# Altium schematic sheet Relay controll extension board v1.5.SchDoc: Power Relay board
size A4; DrawnBy: oaba200; Revision: CBD200509-11 V1.5
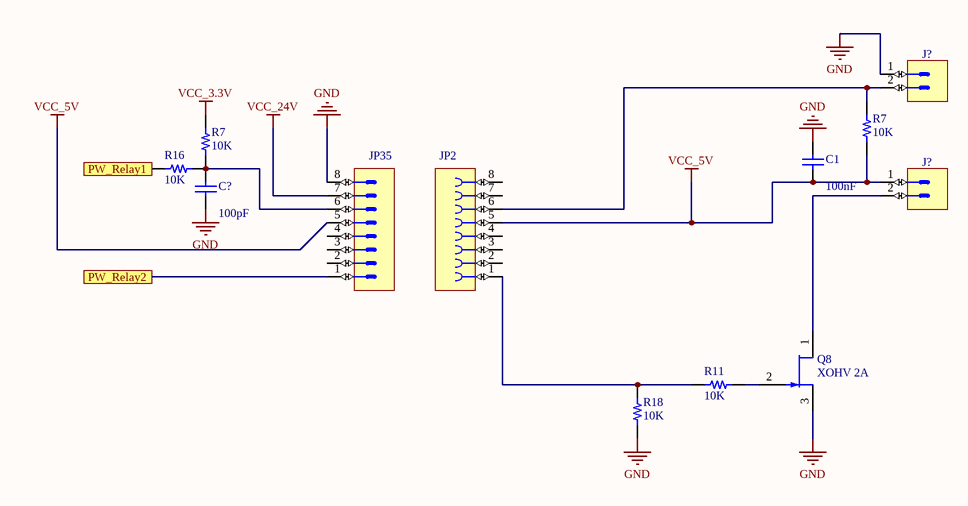
[diagram p0: Relay controll extension board v1.5.SchDoc]

## Parts
(Parts that share a designator on the sheet are numbered #1, #2 ... from top to bottom, then left to right.)
C1  value 100nF  [C1206]  (hidden comment: Cap Semi)
C?  value 100pF  [C1206]  (hidden comment: Cap Semi)
J?#1  (no value)
J?#2  (no value)
JP2  (no value)
JP35  (no value)
Q8  XOHV 2A  [TO-254-AA]
R7#1  10K  [RES 0805_2012]
R7#2  10K  [RES 0805_2012]
R11  10K  [RES 0805_2012]
R16  10K  [RES 0805_2012]
R18  10K  [RES 0805_2012]

## Ports
PW_Relay1, PW_Relay2

## Nets
GND: C1.2 C?.1 J?#1.1 JP35.8 Q8.3(S) R18.2
VCC_3.3V: R7#2.1
VCC_5V: C1.1 J?#2.1 JP2.5 JP35.5 R7#1.1
VCC_24V: JP35.7
PW_Relay1: R16.1 ; port PW_Relay1
PW_Relay2: JP35.1 ; port PW_Relay2
NetC?_2: C?.2 JP35.6 R7#2.2 R16.2
NetJ?#1_2: J?#1.2 JP2.6 R7#1.2
NetJ?#2_2: J?#2.2 Q8.1(D)
NetJP2_1: JP2.1 R11.1 R18.1
NetQ8_2: Q8.2(G) R11.2

Not connected (* = marked no-connect by the designer): JP2 2 3 4 7 8; JP35 2 3 4

## Library data of the parts
C1 C? = Cap Semi: Capacitor (Semiconductor SIM Model); Published: 8-Jun-2000; LatestRevisionDate: 29-May-2009; LatestRevisionNote: IPC-7351 Footprint Added.; PackageReference: C1206; Publisher: Altium Limited; PackageDescription: Chip Capacitor
J?#1 J?#2 = Connector 2 Male
JP2 = Connector 8 Female
JP35 = Connector 8 Male
Q8 = JFET-N: N-Channel JFET; Published: 8-Jun-2000; LatestRevisionDate: 17-Jul-2002; LatestRevisionNote: Re-released for DXP Platform.; PackageReference: TO-254-AA; Publisher: Altium Limited; Code_JEDEC: TO-254-AA
R7#1 R7#2 R11 R16 R18 = Resistor: SMT Resistor
  R7#1 R7#2 R11 R18: VALUE: 10K
  R16: value: 10K